# EAGLE design LB_i11_Pressure_Sensor-v03(4_4) (EAGLE 6.6.0)
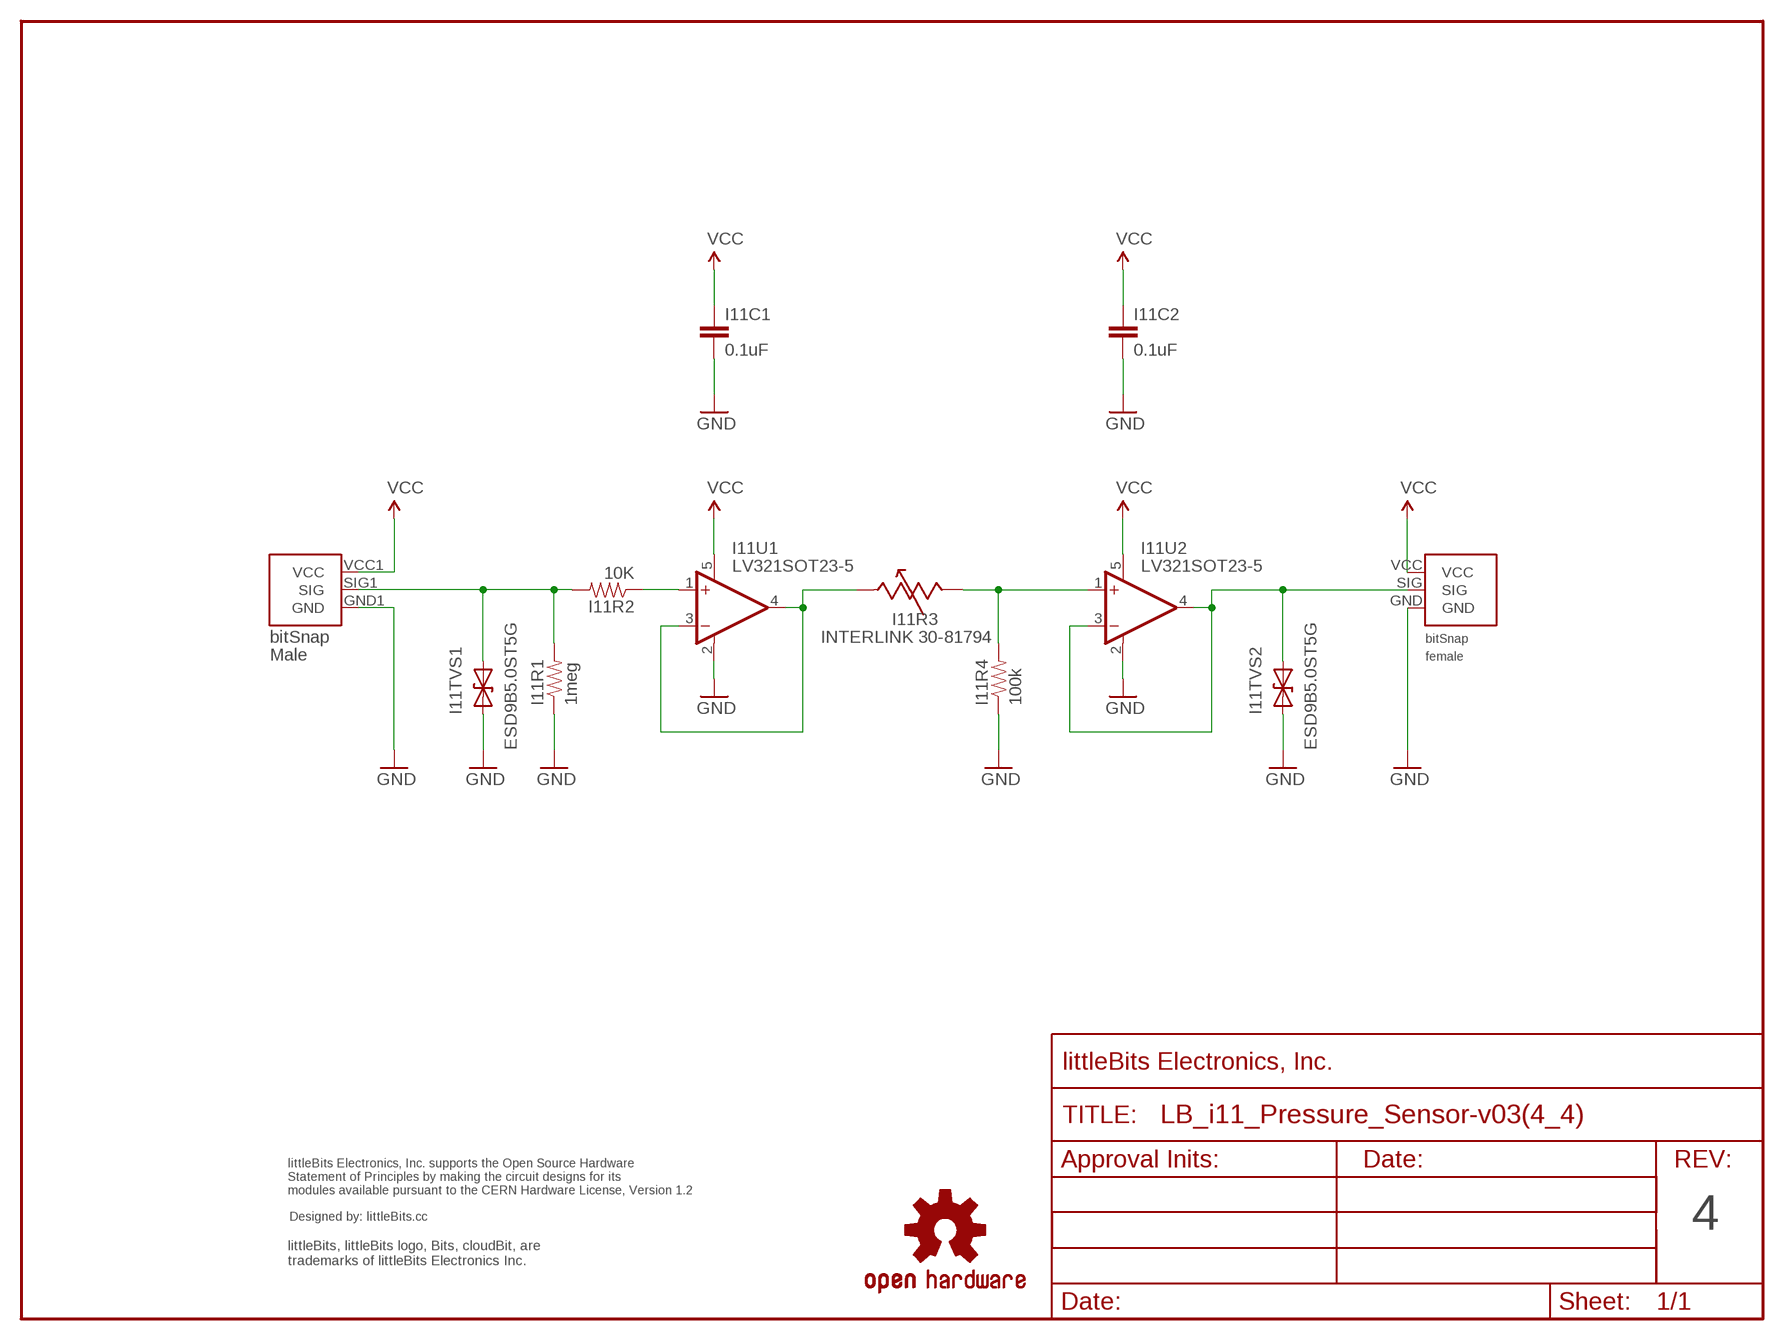
[diagram p0: schematic, sheet 1]

## Parts
FRAME1  FRAME-LETTER-OHWOHW  [FABDWG01-OHW]
I11BSF1  BITSNAP_V03_FEMALE  [BITSNAP_V03_FEMALE]
I11BSM1  BITSNAP_V03_MALE  [BITSNAP_V03_MALE]
I11C1  0.1uF  CAP0603-CAP  [0603-CAP]
I11C2  0.1uF  CAP0603-CAP  [0603-CAP]
I11R1  1meg  RESISTOR0603  [RES-0603]
I11R2  10K  RESISTOR0603  [RES-0603]
I11R3  INTERLINK 30-81794  FSR-SMD  [FSR-SMD]
I11R4  100k  RESISTOR0603-RES  [0603-RES]
I11TVS1  ESD9B5.0ST5G  DIODE-TVSSOD-923  [SOD-923]
I11TVS2  ESD9B5.0ST5G  DIODE-TVSSOD-923  [SOD-923]
I11U1  LV321SOT23-5  [SOT23-5]
I11U2  LV321SOT23-5  [SOT23-5]
U$1  OSHW-LOGOL  [OSHW-LOGO-L]
U$7  LB_CREDITS  [OSHWCREDIT]

## Nets
GND: I11BSF1.GND I11BSM1.GND1(GND) I11C1.2 I11C2.2 I11R1.1 I11R4.1 I11TVS1.1(A) I11TVS2.1(A) I11U1.2(V-) I11U2.2(V-)
N$1: I11R3.2(A) I11R4.2 I11U2.1(+IN)
N$5: I11BSF1.SIG I11TVS2.2(C) I11U2.3(-IN) I11U2.4(OUT)
N$6: I11R3.1 I11U1.3(-IN) I11U1.4(OUT)
N$8: I11R2.1 I11U1.1(+IN)
SIG2: I11BSM1.SIG1(SIG) I11R1.2 I11R2.2 I11TVS1.2(C)
VCC: I11BSF1.VCC I11BSM1.VCC1(VCC) I11C1.1 I11C2.1 I11U1.5(V+) I11U2.5(V+)

## Notes on the sheet
- 4

## Library data of the parts
FRAME1 = LITTLEBITS:FRAME-LETTER-OHW
I11BSF1 = bitSnap:BITSNAP_V03_FEMALE
I11BSM1 = bitSnap:BITSNAP_V03_MALE
I11C1 I11C2 = SparkFun:CAP: Capacitor Standard 0603 ceramic capacitor, and 0.1" leaded capacitor.
I11R1 I11R2 = LITTLEBITS:RESISTOR
I11R3 = LITTLEBITS:FSR-SMD
I11R4 = SparkFun:RESISTOR: Resistor Basic schematic elements and footprints for 0603, 1206, and PTH 1/10th watt (small) resistors.
I11TVS1 I11TVS2 = LITTLEBITS:DIODE-TVS: Bidirectional Transient Voltage Suppression Diode: Device conducts in avalanche mode after reaching a part dependent voltage threshold. Used for limiting voltage spikes on ESD sensitive inputs and outputs.; IEC_ESD_PROT0: +/-18kV; LB_PN: ?; MPN: ESD9B5.0ST5G; V_CLAMP: ?; V_OPERATION: 5V
I11U1 I11U2 = LITTLEBITS:LV321
U$1 = LITTLEBITS:OSHW-LOGO: Open Source Hardware Logo This logo indicates the piece of hardware it is found on incorporates a OSHW license and/or adheres to the definition of open source hardware found here: http://freedomdefined.org/OSHW
U$7 = LITTLEBITS:LB_CREDITS

## Board
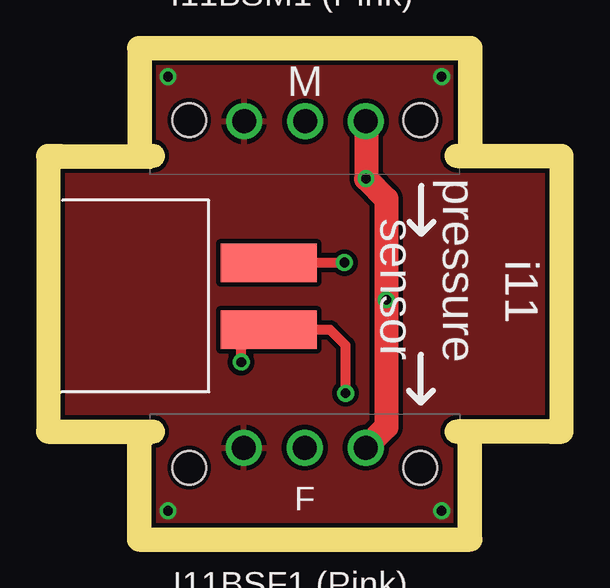
[diagram p1: board, top side]
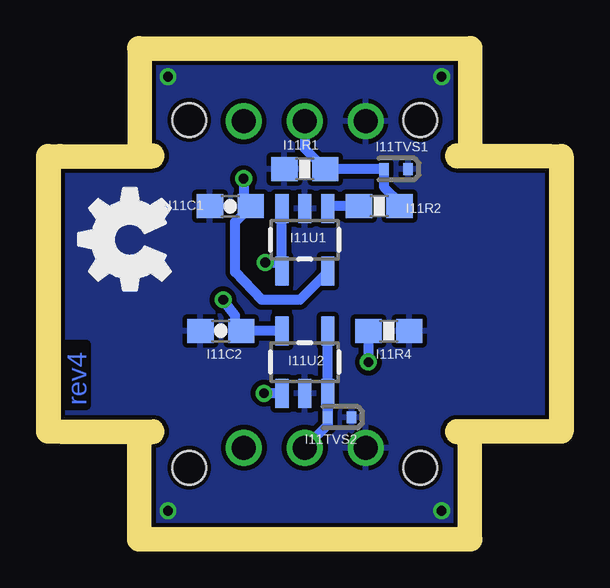
[diagram p2: board, bottom side, seen from below]

Size 20.4 x 19.5 mm. Coordinates in mm from the lower left corner, seen from the top.
Outline: 0,4.5 0,15
Outline: 20.4,15 20.4,4.5
Copper layers (1*16): Top 0.035mm / dielectric 1.5mm / Bottom 0.035mm
Design rules "default": minimum track width 0.2mm, minimum drill 0.4mm, track to track 0.2mm, track to pad 0.2mm, pad to pad 0.2mm, via to via 0.2mm, smd to smd 0mil, copper to edge 0.2mm, drill to drill 0.2mm, minimum pad ring 0.2mm, minimum via ring 0.15mm, stop-mask expansion 0.1mm, vias tented up to drill 0mil, thermal gap 0.2mm
Milling: 6 lines

### Footprints (pad centres in the part's own frame; a part is rotated, then mirrored left to right if it is on the bottom)
BITSNAP_V03_FEMALE = drill 1: GND 3.91,3.33; SIG 6.45,3.33; VCC 8.99,3.33 | hole 1.4: 1.63,2.5; 11.27,2.5
BITSNAP_V03_MALE = drill 1: GND1 8.98,2.56; SIG1 6.44,2.56; VCC1 3.9,2.56 | hole 1.4: 11.27,2.5; 1.63,2.5
0603-CAP = smd 1.1 x 1: 1 -0.85,0; 2 0.85,0
RES-0603 = smd 1.1 x 1: 1 -0.85,0; 2 0.85,0
FSR-SMD = smd 1.6 x 4: 1 0.6,2.2; 2 3.4,2.2
0603-RES = smd 1.1 x 1: 1 -0.85,0; 2 0.85,0
SOD-923 = smd 0.4 x 0.5: 1 -0.5,0; 2 0.5,0
SOT23-5 = smd 0.55 x 1.2: 1 -0.95,-1.3; 2 0,-1.3; 3 0.95,-1.3; 4 0.95,1.3; 5 -0.95,1.3

### Placement (x,y rotation side)
FRAME1  0,0 0 top
I11BSF1  3.75,0 0 top
I11BSM1  16.65,19.5 180 top
I11C1  13.3,13.4 180 bottom
I11C2  13.7,8.2 180 bottom
I11R1  10.2,14.95 0 bottom
I11R2  7.1,13.4 0 bottom
I11R3  6.5,11.65 270 top
I11R4  6.7,8.2 180 bottom
I11TVS1  6.4,14.95 180 bottom
I11TVS2  8.75,4.6 180 bottom
I11U1  10.2,12 180 bottom
I11U2  10.2,6.9 0 bottom
U$1  -25.7,-70 0 top  (outside the outline)
U$6  [OSHW_FILLX150_NOTEXT]  15.81,9.06 0 top
U$7  -90.93,-62.78 0 top  (outside the outline)

### Tracks (layer width: path | path; a pad name or v marks a point on that pad's centre or on a via)
GND  (via drill 0.41)
  other vias: 15.9,0.7 4.5,0.7 4.5,18.8 15.9,18.8
  pour Bottom: 0.15,19.37 0.15,0.15 20.27,0.15 20.27,19.37
  pour Top: 0.15,19.37 0.15,0.15 20.27,0.15 20.27,19.37
N$1  (via drill 0.41)
  Top 0.406: v11.9,5.6 11.9,7.6 11.25,8.25 I11R3.2 7.55,8.25 v7.55,6.9
  Bottom 0.406: I11U2.1 11.75,5.6 v11.9,5.6 | I11R4.2 v7.55,6.9
N$5
  Bottom 0.406: I11U2.3 9.25,4.28 I11BSF1.SIG | I11U2.3 | I11U2.3 9.25,6.9 | 9.25,6.9 I11U2.4 | I11TVS2.2 9.25,6.9
N$6  (via drill 0.41)
  Top 0.406: I11R3.1 v11.85,11.05
  Bottom 0.406: v11.85,11.05 11.15,11.05 I11U1.4 I11U1.3
N$8
  Bottom 0.406: I11R2.1 9.25,13.4 9.15,13.3 9.25,13.25 I11U1.1
SIG2
  Bottom 0.406: I11BSM1.SIG1 10.21,15.81 I11R1.2 I11TVS1.2 6.9,14.2 6.25,13.55 I11R2.2
VCC  (via drill 0.41)
  Top 1: I11BSM1.VCC1 12.75,16.85 v12.75,14.55 13.6,13.7 v13.6,9.5 13.6,4.19 I11BSF1.VCC
  Bottom 0.406: v12.75,14.55 12.75,13.65 12.45,13.5 I11C1.1 13.1,12.75 13.1,10.65 12,9.5 11.5,9.5 10.4,9.5 9.45,10.45 I11U1.5 | I11U2.5 12.5,8.2 12.55,7.9 I11C2.1 13.1,8.35 13.1,8.85 v13.6,9.5 | I11U2.5

### Text on the board
Bottom: rev4
tPlace: pressure | sensor | i11
tNames: I11BSM1 (Pink) | I11BSF1 (Pink)
Milling: 1mm DIA. ROUTER PATH
dxf: 4 | Pressure Sensor Bit
tDocu: INTERLINK 30-81794